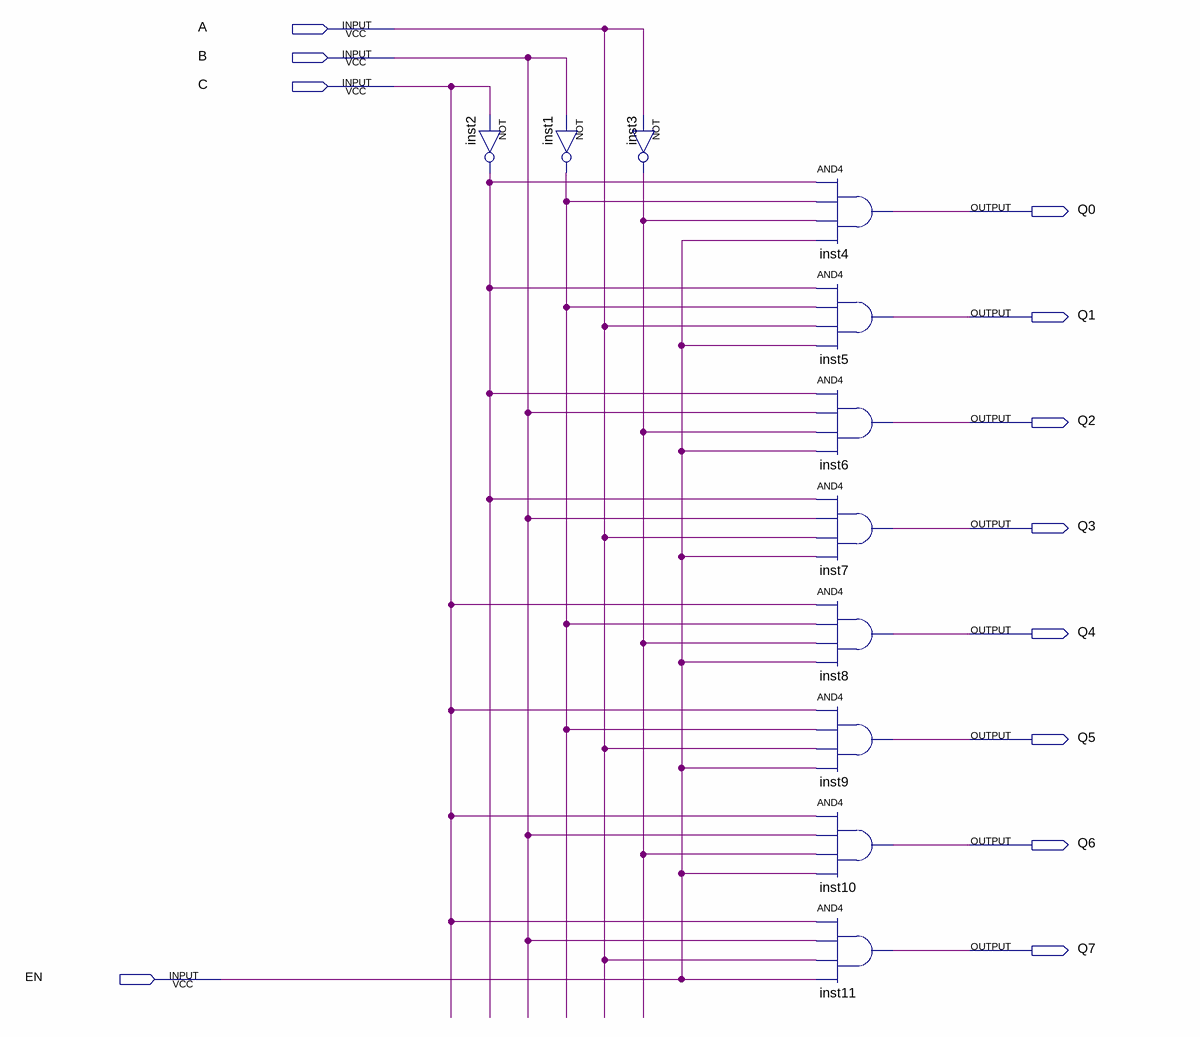
[diagram p0: schematic sheet]
// Quartus schematic ex_05.bdf as structural Verilog: 11 symbols, 12 pins
module ex_05 (
  input  A,
  input  B,
  input  C,
  input  EN,
  output Q0,
  output Q1,
  output Q2,
  output Q3,
  output Q4,
  output Q5,
  output Q6,
  output Q7
);

  wire inst1_out, inst2_out, inst3_out;

  not inst2 (inst2_out, C);
  not inst1 (inst1_out, B);
  not inst3 (inst3_out, A);
  and inst4 (Q0, inst2_out, inst1_out, inst3_out, EN);
  and inst5 (Q1, inst2_out, inst1_out, A, EN);
  and inst6 (Q2, inst2_out, B, inst3_out, EN);
  and inst7 (Q3, inst2_out, B, A, EN);
  and inst8 (Q4, C, inst1_out, inst3_out, EN);
  and inst9 (Q5, C, inst1_out, A, EN);
  and inst10 (Q6, C, B, inst3_out, EN);
  and inst11 (Q7, C, B, A, EN);
endmodule
